# EAGLE design NuseryRoomTempMon (EAGLE 5.10)
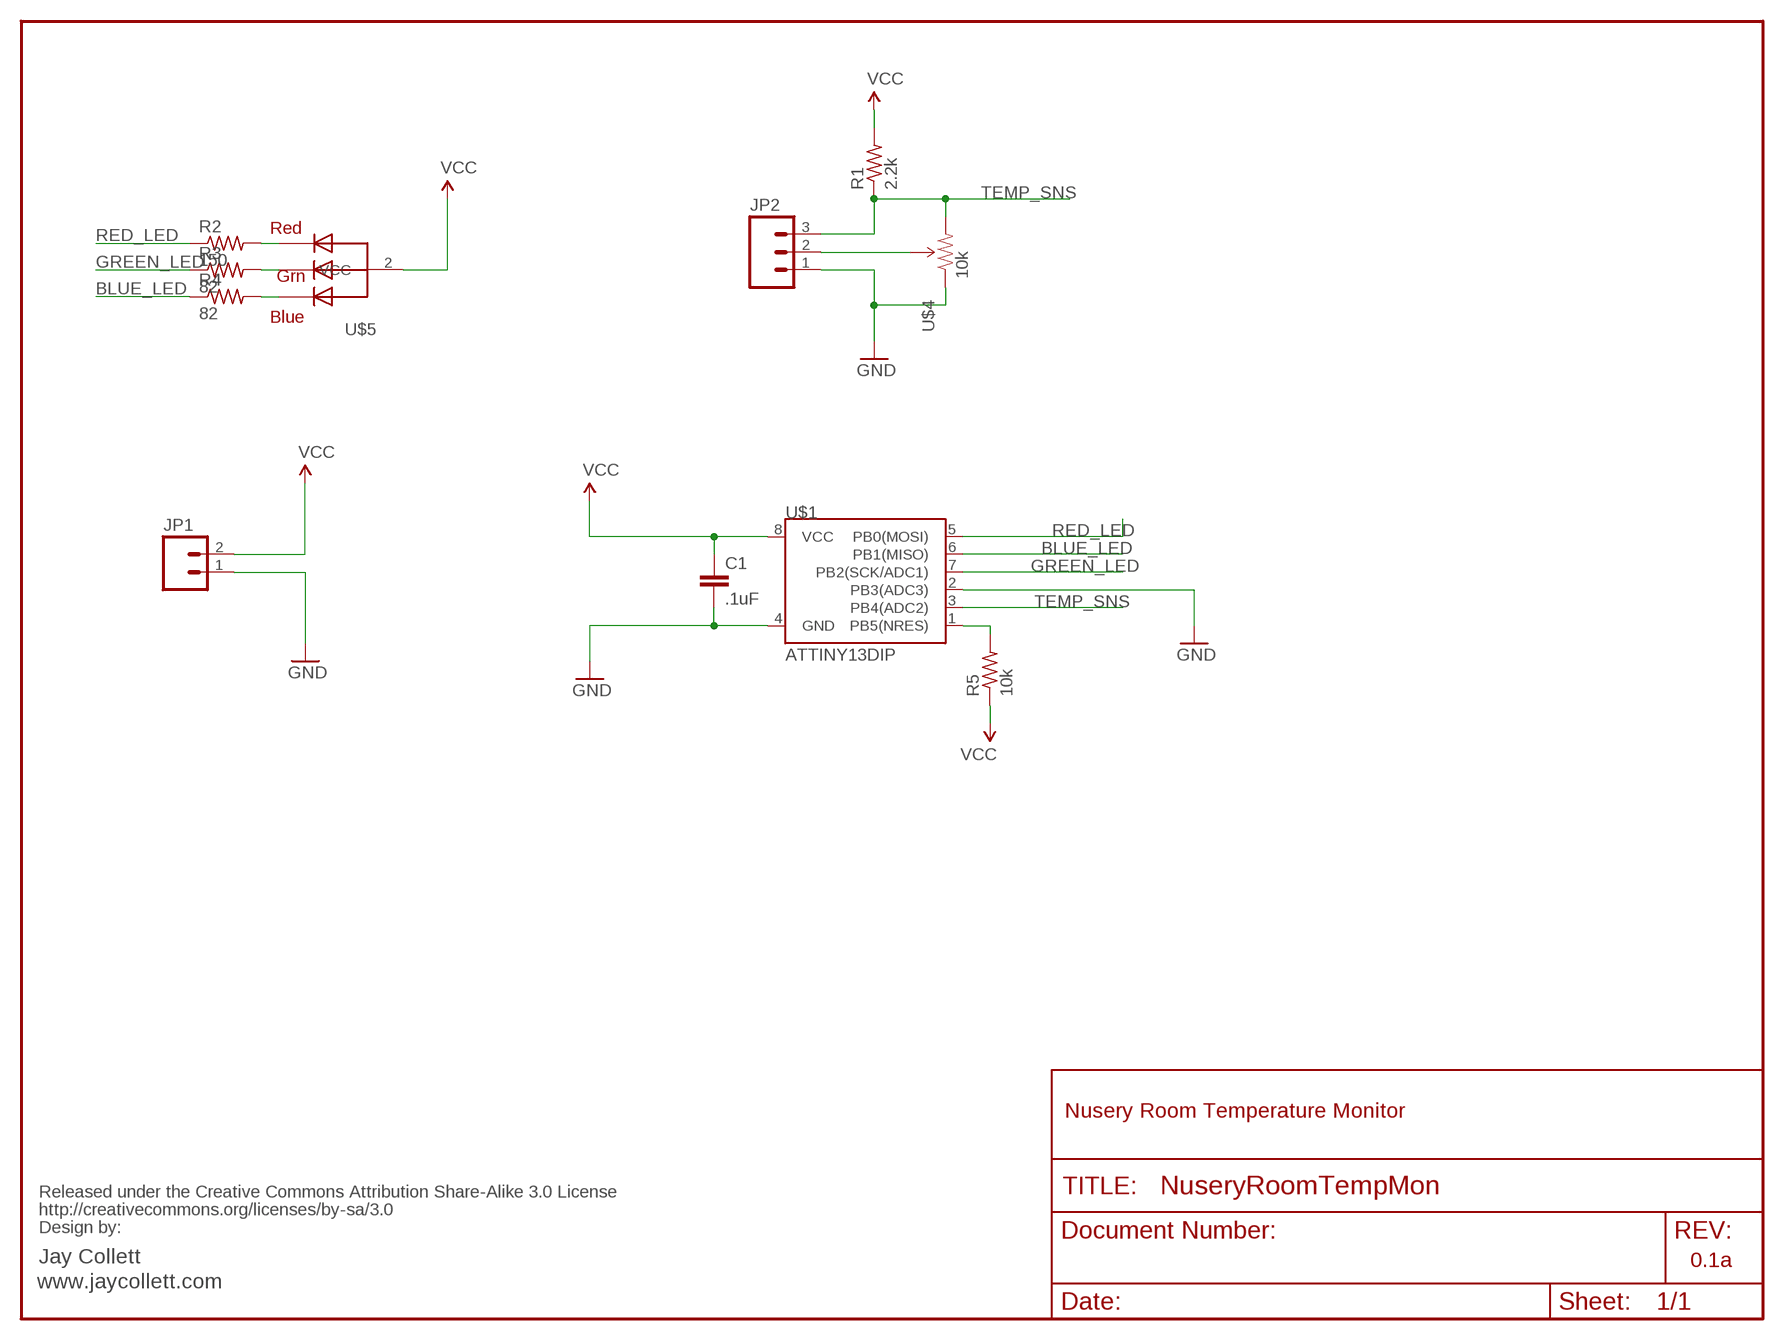
[diagram p0: schematic, sheet 1]

## Parts
C1  .1uF  CAPPTH  [CAP-PTH-SMALL]
JP1  M023.5MM_LOCK  [SCREWTERMINAL-3.5MM-2_LOCK]
JP2  M03LOCK_LONGPADS  [1X03_LOCK_LONGPADS]
R1  2.2k  R-US_0207/10  [0207/10]
R2  150  R-US_0207/10  [0207/10]
R3  82  R-US_0207/10  [0207/10]
R4  82  R-US_0207/10  [0207/10]
R5  10k  R-US_0207/10  [0207/10]
U$1  ATTINY13DIP  [DIP08]
U$2  CREATIVE_COMMONS  [CREATIVE_COMMONS]
U$4  10k  TRIMPOTPTH  [TRIM_POT_PTH]
U$5  RGBLED_CA  [LED5MMRGB]

## Nets
BLUE_LED: R4.1 U$1.6(PB1(MISO))
GND: C1.2 JP1.1 JP2.1 U$1.2(PB3(ADC3)) U$1.4(GND) U$4.1(CCW)
GREEN_LED: R3.1 U$1.7(PB2(SCK/ADC1))
N$1: R2.2 U$5.1(RED)
N$3: R3.2 U$5.3(GREEN)
N$4: R4.2 U$5.4(BLUE)
N$5: R5.2 U$1.1(PB5(NRES))
N$7: JP2.2 U$4.2(WIPER)
RED_LED: R2.1 U$1.5(PB0(MOSI))
TEMP_SNS: JP2.3 R1.1 U$1.3(PB4(ADC2)) U$4.3(CW)
VCC: C1.1 JP1.2 R1.2 R5.1 U$1.8(VCC) U$5.2(VCC)

## Notes on the sheet
- Nusery Room Temperature Monitor
- Jay Collett | 0.1a
- www.jaycollett.com

## Library data of the parts
C1 = SparkFun:CAP: Capacitor Standard 0603 ceramic capacitor, and 0.1" leaded capacitor.
JP1 = SparkFun:M02: Header 2 Standard 2-pin 0.1" header. Use with straight break away headers (SKU : PRT-00116), right angle break away headers (PRT-00553), swiss pins (PRT-00743), machine pins (PRT-00117), and female headers (PRT-00115). Molex polarized connector foot print use with SKU : PRT-08233 with associated crimp pins and housings.
JP2 = SparkFun:M03: Header 3 Standard 3-pin 0.1" header. Use with straight break away headers (SKU : PRT-00116), right angle break away headers (PRT-00553), swiss pins (PRT-00743), machine pins (PRT-00117), and female headers (PRT-00115). Molex polarized connector foot print use with SKU : PRT-08232 with associated crimp pins and housings.
R1-R5 = adafruit:R-US_: RESISTOR, American symbol
U$1 = SparkFun:ATTINY13
U$2 = SparkFun:CREATIVE_COMMONS
U$4 = SparkFun:TRIMPOT
U$5 = adafruit:RGBLED_CA: RGB LED, common-anode Staggered pins http://www.ladyada.net/library/pcb/eaglelibrary.html

## Board
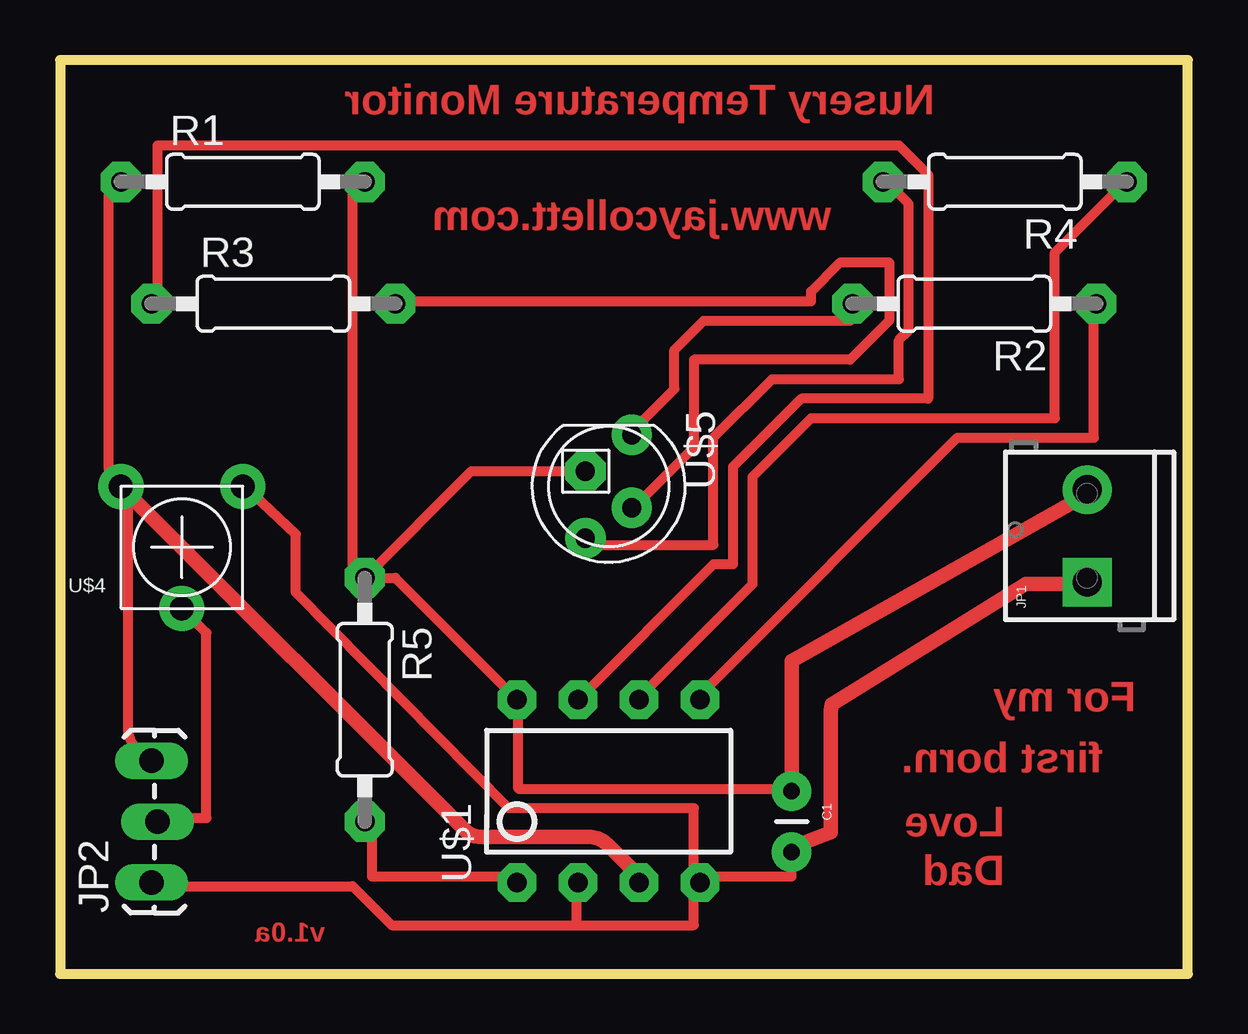
[diagram p1: board, top side]

Size 46.99 x 38.1 mm. Coordinates in mm from the lower left corner, seen from the top.
Outline: 0,0 46.99,0 46.99,38.1 0,38.1 0,0
Copper layers (1*16): Top 0.035mm / dielectric 1.5mm / Bottom 0.035mm
Design rules "default *": minimum track width 16mil, minimum drill 24mil, track to track 16mil, track to pad 16mil, pad to pad 16mil, via to via 8mil, smd to smd 8mil, copper to edge 40mil, drill to drill 16mil, minimum pad ring 10mil, minimum via ring 8mil, stop-mask expansion 4mil, vias tented up to drill 0mil, thermal gap 10mil

### Footprints (pad centres in the part's own frame; a part is rotated, then mirrored left to right if it is on the bottom)
CAP-PTH-SMALL = drill 0.7 pad 1.651 round: 1 0,0; 2 2.54,0
SCREWTERMINAL-3.5MM-2_LOCK = drill 1.2 pad 2.032 square: 1 -0.178,0 | drill 1.2 pad 2.032 round: 2 3.678,0
1X03_LOCK_LONGPADS = drill 1.016 long: 1 0,0; 2 2.54,-0.254; 3 5.08,0
0207/10 = drill 0.813 pad 1.676 octagon: 1 -5.08,0; 2 5.08,0
DIP08 = drill 0.813 pad 1.6 octagon: 1 -3.81,-3.81; 2 -1.27,-3.81; 3 1.27,-3.81; 4 3.81,-3.81; 5 3.81,3.81; 6 1.27,3.81; 7 -1.27,3.81; 8 -3.81,3.81
TRIM_POT_PTH = drill 1 pad 1.88 round: 1 -2.54,-2.54; 2 0,2.54; 3 2.54,-2.54
LED5MMRGB = drill 0.8 pad 1.676 round: 1 -2.159,0.968; 3 0.889,0.968; 4 2.159,-0.968 | drill 0.8 pad 1.676 octagon: 2 -0.635,-0.968

### Placement (x,y rotation side)
C1  30.48,7.62 270 top
JP1  42.8,16.51 90 top
JP2  3.81,3.81 90 top
R1  7.62,33.02 0 top
R2  38.1,27.94 180 top
R3  8.89,27.94 0 top
R4  39.37,33.02 180 top
R5  12.7,11.43 270 top
U$1  22.86,7.62 0 top
U$2  0,0 0 top
U$4  5.08,17.78 180 top
U$5  22.86,20.32 270 top

### Tracks (layer width: path | path; a pad name or v marks a point on that pad's centre or on a via)
BLUE_LED
  Top 0.406: U$1.6 24.38,11.79 28.85,16.26 28.85,20.73 31.29,23.16 41.45,23.16 41.45,30.07 44.3,32.92 R4.1
GND
  Top 0.406: 21.54,2.03 13.82,2.03 12.19,3.66 4.06,3.66 JP2.1 | 21.54,2.03 21.54,3.66 U$1.2 | U$1.4 26.82,4.06 30.48,4.06 C1.2 30.48,5.28 | U$4.1 7.72,20.32 9.83,18.34 9.83,15.9 18.69,6.91 26.42,6.91 26.42,4.06 U$1.4 | 42.67,16.26 JP1.1 | 21.54,2.03 26.42,2.03 26.42,3.66 U$1.4
  Top 0.61: 42.67,16.26 40.23,16.26 32.16,11.23 32.11,10.97 32.11,5.89 30.48,5.28
GREEN_LED
  Top 0.406: U$1.7 27.23,17.07 28.04,17.07 28.04,21.13 30.89,23.98 36.17,23.98 36.17,33.33 34.95,34.54 4.06,34.54 4.06,28.04 R3.1
N$1
  Top 0.406: U$5.1 23.98,22.76 25.6,24.38 25.6,26.01 26.82,27.23 32.92,27.23 32.92,27.64 R2.2
N$3
  Top 0.406: R3.2 14.22,28.04 31.29,28.04 31.29,28.45 32.51,29.67 34.54,29.67 34.54,27.23 32.92,25.6 26.42,25.6 26.42,21.95 23.98,19.51 U$5.3
N$4
  Top 0.406: U$5.4 21.95,17.88 27.23,17.88 27.23,22.35 29.67,24.79 34.95,24.79 34.95,26.42 35.36,26.82 35.36,32.11 34.54,32.92 R4.2
N$5
  Top 0.406: U$1.1 18.69,4.06 13.01,4.06 13.01,6.1 R5.2
N$7
  Top 0.406: JP2.2 4.06,6.5 6.1,6.5 6.1,14.22 U$4.2
RED_LED
  Top 0.406: U$1.5 26.82,11.79 37.39,22.35 43.08,22.35 43.08,27.64 R2.1
TEMP_SNS
  Top 0.406: 2.85,19.91 2.85,20.32 U$4.3 | 2.85,19.91 2.85,10.19 arc45 3.15,9.45 3.66,8.94 JP2.3 | 2.85,19.91 U$4.3 | R1.1 2.03,32.51 2.03,21.14 arc45 2.33,20.43 2.44,20.32 U$4.3
  Top 0.61: U$1.3 24.13,4.06 22.8,5.39 arc45 22.03,5.71 17.52,5.71 arc-45 16.88,5.98 U$4.3
VCC
  Top 0.406: R1.2 12.19,32.51 12.19,17.07 12.6,16.66 R5.1 | 42.67,19.91 JP1.2 | C1.1 30.48,7.72 19.1,7.72 19.1,11.38 U$1.8 13.97,16.51 R5.1 | U$5.2 17.14,20.95 R5.1
  Top 0.61: 42.67,19.91 30.48,13.06 30.48,7.72

### Text on the board
Top: Nusery Temperature Monitor | www.jaycollett.com | For my | first born. | Love | Dad | v1.0a